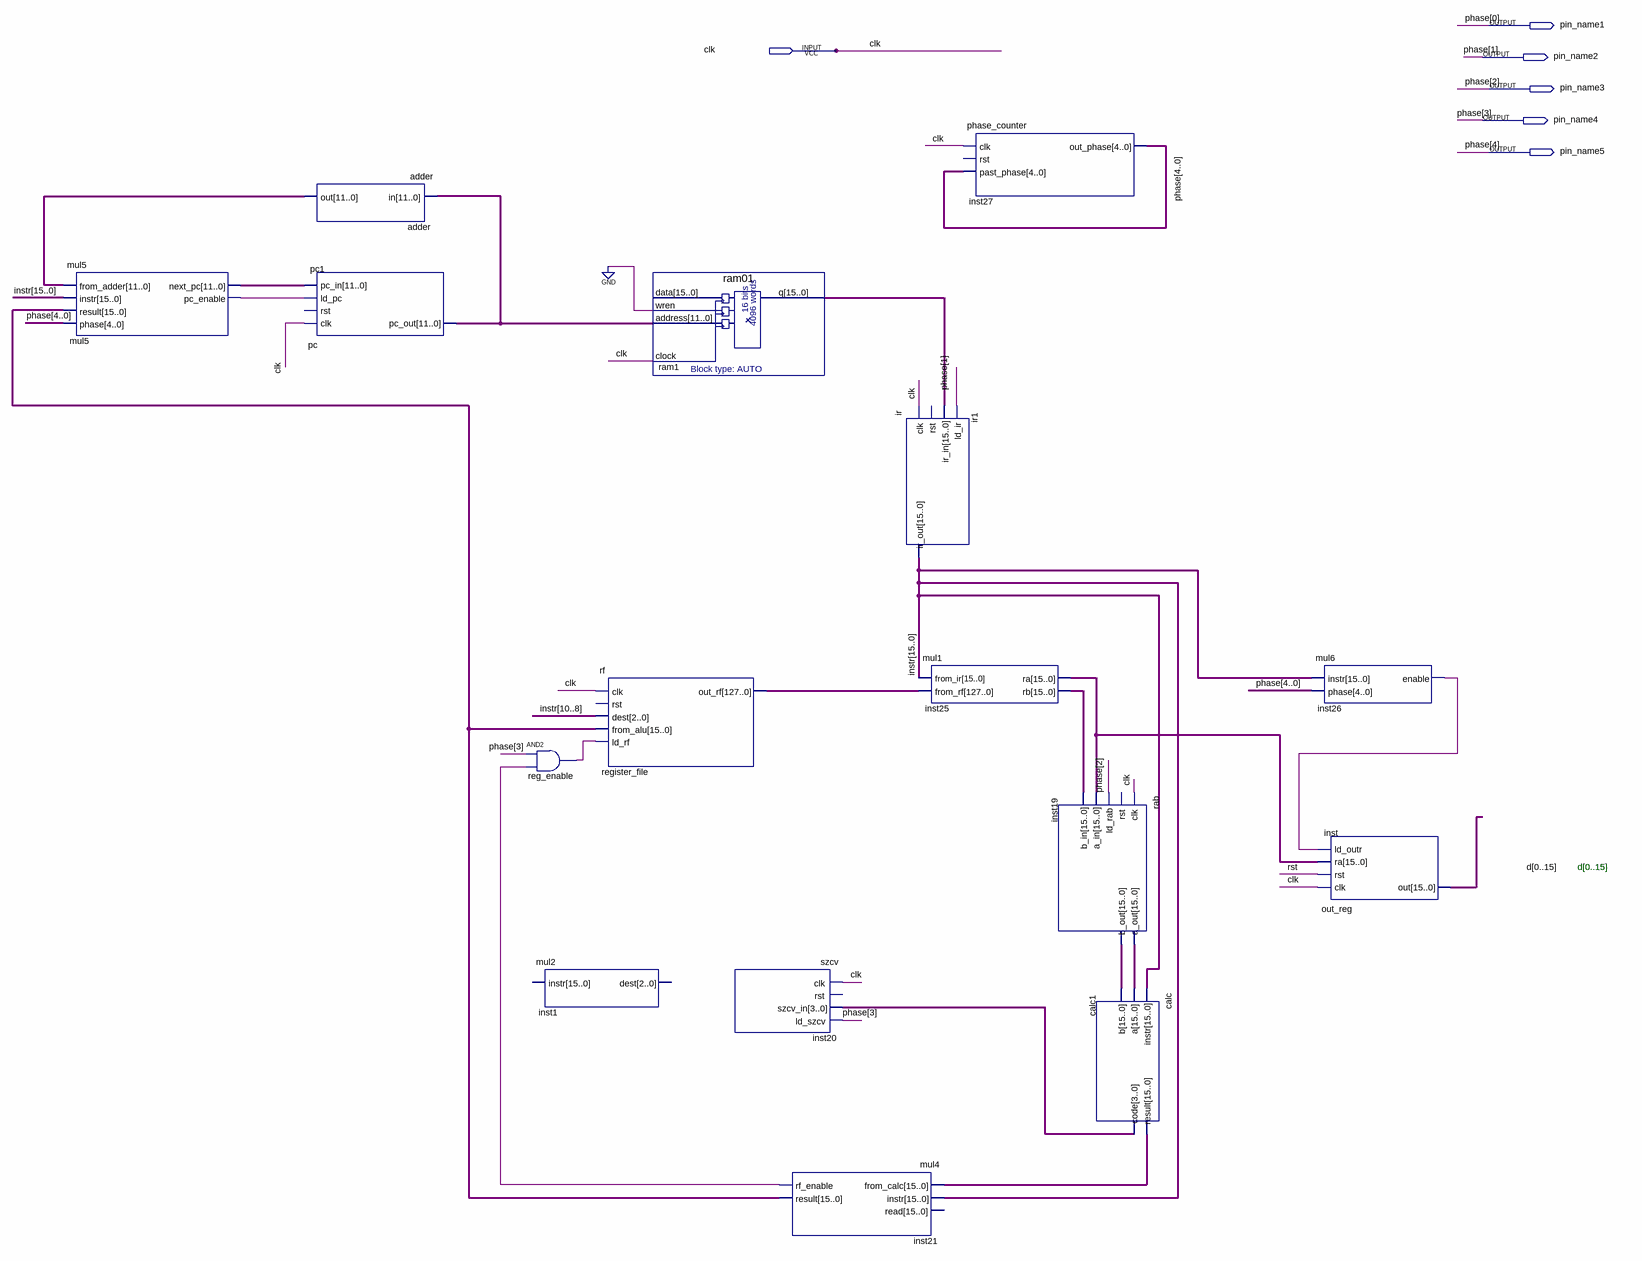
[diagram p0: schematic sheet]
// Quartus schematic SIMPLE.bdf as structural Verilog: 16 symbols, 6 pins
module SIMPLE (
  input  clk,
  output pin_name1,
  output pin_name2,
  output pin_name3,
  output pin_name4,
  output pin_name5
);

  wire inst21_rf_enable, inst26_enable, mul5_pc_enable, reg_enable_out, rst;
  wire [3:0] calc1_code;
  wire [11:0] adder_out, mul5_next_pc, pc1_pc_out;
  wire [15:0] calc1_result, d, inst19_a_out, inst19_b_out, inst21_result, inst25_ra, inst25_rb, instr, ram1_q;
  wire [127:0] register_file_out_rf;

  mul5 mul5 (
    .from_adder(adder_out), .instr(instr), .result(inst21_result),
    .phase({pin_name5, pin_name4, pin_name3, pin_name2, pin_name1}), .next_pc(mul5_next_pc),
    .pc_enable(mul5_pc_enable));
  adder adder (.in(pc1_pc_out), .out(adder_out));
  pc pc1 (.clk(clk), .ld_pc(mul5_pc_enable), .pc_in(mul5_next_pc), .pc_out(pc1_pc_out));  // open: rst
  and reg_enable (reg_enable_out, pin_name4, inst21_rf_enable);
  mul2 inst1 ();  // open: instr, dest
  rf register_file (
    .clk(clk), .dest(instr[10:8]), .from_alu(inst21_result), .ld_rf(reg_enable_out),
    .out_rf(register_file_out_rf));  // open: rst
  ram01 ram1 (.wren(1'b0), .address(pc1_pc_out), .clock(clk), .q(ram1_q));  // open: data
  szcv inst20 (.clk(clk), .szcv_in(calc1_code), .ld_szcv(pin_name4));  // open: rst
  mul4 inst21 (
    .from_calc(calc1_result), .instr(instr), .rf_enable(inst21_rf_enable), .result(inst21_result));  // open: read
  ir ir1 (.clk(clk), .ir_in(ram1_q), .ld_ir(pin_name2), .ir_out(instr));  // open: rst
  mul1 inst25 (.from_ir(instr), .from_rf(register_file_out_rf), .ra(inst25_ra), .rb(inst25_rb));
  phase_counter inst27 (
    .clk(clk), .past_phase({pin_name5, pin_name4, pin_name3, pin_name2, pin_name1}),
    .out_phase({pin_name5, pin_name4, pin_name3, pin_name2, pin_name1}));  // open: rst
  rab inst19 (
    .clk(clk), .ld_rab(pin_name3), .a_in(inst25_ra), .b_in(inst25_rb), .a_out(inst19_a_out),
    .b_out(inst19_b_out));  // open: rst
  calc calc1 (.instr(instr), .a(inst19_a_out), .b(inst19_b_out), .result(calc1_result), .code(calc1_code));
  mul6 inst26 (.instr(instr), .phase({pin_name5, pin_name4, pin_name3, pin_name2, pin_name1}), .enable(inst26_enable));
  out_reg inst (
    .clk(clk), .rst(rst), .ra(inst25_ra), .ld_outr(inst26_enable),
    .out({d[0], d[1], d[2], d[3], d[4], d[5], d[6], d[7], d[8], d[9], d[10], d[11], d[12], d[13], d[14], d[15]}));

  // Other names for the same wires on the sheet: phase[4:0] = {pin_name5, pin_name4, pin_name3, pin_name2, pin_name1}

  // Notes on the sheet:
  //   d[0..15]
  //   d[0..15]
endmodule
